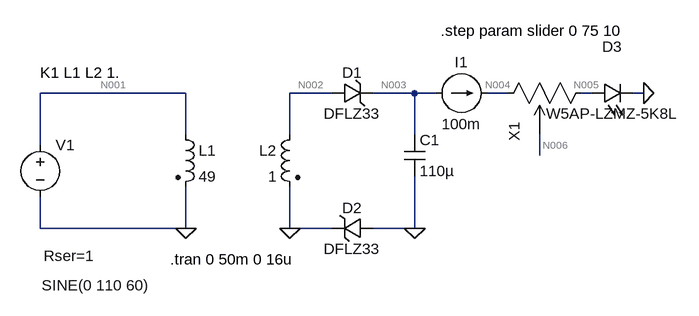
[diagram p0: schematic Fonte Eletrônica.asc]
Fonte Eletrônica.asc, the LTspice schematic file:
Version 4
SHEET 1 880 680
WIRE -400 -240 -624 -240
WIRE -176 -240 -240 -240
WIRE -48 -240 -112 -240
WIRE -16 -240 -48 -240
WIRE 96 -240 64 -240
WIRE 224 -240 208 -240
WIRE 304 -240 288 -240
WIRE -400 -176 -400 -240
WIRE -240 -176 -240 -240
WIRE -48 -176 -48 -240
WIRE -624 -160 -624 -240
WIRE 144 -144 144 -176
WIRE -624 -32 -624 -80
WIRE -400 -32 -400 -96
WIRE -400 -32 -624 -32
WIRE -240 -32 -240 -96
WIRE -176 -32 -240 -32
WIRE -48 -32 -48 -112
WIRE -48 -32 -112 -32
FLAG -400 -32 0
FLAG -240 -32 0
FLAG -48 -32 0
FLAG 304 -240 0
SYMBOL voltage -624 -176 R0
WINDOW 3 2 232 Left 2
WINDOW 123 0 0 Left 0
WINDOW 39 5 187 Left 2
SYMATTR Value SINE(0 110 60)
SYMATTR SpiceLine Rser=1
SYMATTR InstName V1
SYMBOL ind2 -416 -192 R0
SYMATTR InstName L1
SYMATTR Value 49
SYMBOL ind2 -224 -192 M0
SYMATTR InstName L2
SYMATTR Value 1
SYMBOL zener -176 -224 R270
WINDOW 0 32 32 VTop 2
WINDOW 3 0 32 VBottom 2
SYMATTR InstName D1
SYMATTR Value DFLZ33
SYMATTR Description Diode
SYMATTR Type diode
SYMBOL zener -112 -48 R90
WINDOW 0 0 32 VBottom 2
WINDOW 3 32 32 VTop 2
SYMATTR InstName D2
SYMATTR Value DFLZ33
SYMATTR Description Diode
SYMATTR Type diode
SYMBOL cap -64 -176 R0
SYMATTR InstName C1
SYMATTR Value 110µ
SYMBOL pot 112 -224 R270
SYMATTR InstName X1
SYMATTR SpiceLine R=120 Val={slider}
SYMBOL current -16 -240 R270
WINDOW 0 32 40 VTop 2
WINDOW 3 -32 40 VBottom 2
WINDOW 123 4 40 VTop 2
WINDOW 39 0 0 Left 0
SYMATTR InstName I1
SYMATTR Value 100m
SYMBOL LED 224 -224 R270
WINDOW 0 72 32 VTop 2
WINDOW 3 0 32 VBottom 2
SYMATTR InstName D3
SYMATTR Value W5AP-LZMZ-5K8L
TEXT -624 -272 Left 2 !K1 L1 L2 1.
TEXT -424 16 Left 2 !.tran 0 50m 0 16u
TEXT -8 -336 Left 2 !.step param slider 0 75 10

The netlist it stands for:
* Fonte Eletrônica.asc
V1 N001 0 SINE(0 110 60) Rser=1
L1 N001 0 49
L2 N002 0 1
D1 N002 N003 DFLZ33
D2 0 0 DFLZ33
C1 N003 0 110µ
XX1 N004 N005 N006 pot R=120 Val={slider}  ; pins 1 2 3
I1 N003 N004 100m
D3 N005 0 W5AP-LZMZ-5K8L
.model D D
.lib standard.dio
K1 L1 L2 1.
.tran 0 50m 0 16u
.step param slider 0 75 10
.backanno
.end

* Results of the author's LTspice run, read from the files saved beside the schematic
* Operating Point (first step), zero values left out:
*   V(n003) = -708.8 mV
*   V(n004) = 14.9 V
*   V(n006) = 2.897 V
*   V(n005) = 2.897 V
*   I(D3) = 100 mA
*   I(D1) = 100 mA
*   I(L2) = -100 mA
*   I(I1) = 100 mA
*   Ix(x1:1) = 100 mA
*   Ix(x1:2) = -100 mA
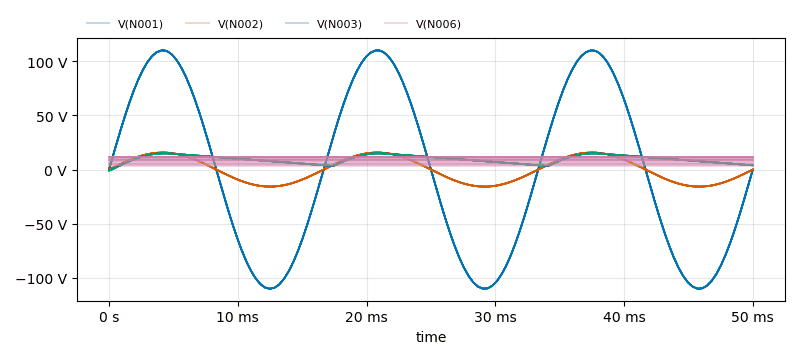
[diagram p1: Transient Analysis of Fonte Eletrônica.asc, plotted from the saved traces]
* Transient Analysis, 9 runs:
*   V(N001) [run 1]: min -110 V, max 110 V, average 11.36 mV, rms 77.75 V, last 14.29 mV
*   V(N001) [run 2]: min -110 V, max 110 V, average 11.29 mV, rms 77.75 V, last 14.29 mV
*   V(N001) [run 3]: min -110 V, max 110 V, average 11.29 mV, rms 77.75 V, last 14.29 mV
*   V(N001) [run 4]: min -110 V, max 110 V, average 11.29 mV, rms 77.75 V, last 14.29 mV
*   V(N001) [run 5]: min -110 V, max 110 V, average 11.29 mV, rms 77.75 V, last 14.29 mV
*   V(N001) [run 6]: min -110 V, max 110 V, average 11.29 mV, rms 77.75 V, last 14.29 mV
*   V(N001) [run 7]: min -110 V, max 110 V, average 11.29 mV, rms 77.75 V, last 14.29 mV
*   V(N001) [run 8]: min -110 V, max 110 V, average 11.29 mV, rms 77.75 V, last 14.29 mV
*   V(N002) [run 1]: min -15.71 V, max 15.71 V, average 1.623 mV, rms 11.11 V, last 2.042 mV
*   V(N002) [run 2]: min -15.71 V, max 15.71 V, average 1.613 mV, rms 11.11 V, last 2.042 mV
*   V(N002) [run 3]: min -15.71 V, max 15.71 V, average 1.613 mV, rms 11.11 V, last 2.042 mV
*   V(N002) [run 4]: min -15.71 V, max 15.71 V, average 1.613 mV, rms 11.11 V, last 2.042 mV
*   V(N002) [run 5]: min -15.71 V, max 15.71 V, average 1.613 mV, rms 11.11 V, last 2.042 mV
*   V(N002) [run 6]: min -15.71 V, max 15.71 V, average 1.613 mV, rms 11.11 V, last 2.042 mV
*   V(N002) [run 7]: min -15.71 V, max 15.71 V, average 1.613 mV, rms 11.11 V, last 2.042 mV
*   V(N002) [run 8]: min -15.71 V, max 15.71 V, average 1.613 mV, rms 11.11 V, last 2.042 mV
*   V(N003) [run 1]: min -708.8 mV, max 14.99 V, average 9.528 V, rms 10.19 V, last 3.933 V
*   V(N003) [run 2]: min -708.8 mV, max 14.99 V, average 9.528 V, rms 10.19 V, last 3.933 V
*   V(N003) [run 3]: min -708.8 mV, max 14.99 V, average 9.528 V, rms 10.19 V, last 3.933 V
*   V(N003) [run 4]: min -708.8 mV, max 14.99 V, average 9.528 V, rms 10.19 V, last 3.933 V
*   V(N003) [run 5]: min -708.8 mV, max 14.99 V, average 9.528 V, rms 10.19 V, last 3.933 V
*   V(N003) [run 6]: min -708.8 mV, max 14.99 V, average 9.528 V, rms 10.19 V, last 3.933 V
*   V(N003) [run 7]: min -708.8 mV, max 14.99 V, average 9.528 V, rms 10.19 V, last 3.933 V
*   V(N003) [run 8]: min -708.8 mV, max 14.99 V, average 9.528 V, rms 10.19 V, last 3.933 V
*   V(N006) [run 1]: min 2.897 V, max 2.897 V, average 2.897 V, rms 2.897 V, last 2.897 V
*   V(N006) [run 2]: min 4.097 V, max 4.097 V, average 4.097 V, rms 4.097 V, last 4.097 V
*   V(N006) [run 3]: min 5.297 V, max 5.297 V, average 5.297 V, rms 5.297 V, last 5.297 V
*   V(N006) [run 4]: min 6.497 V, max 6.497 V, average 6.497 V, rms 6.497 V, last 6.497 V
*   V(N006) [run 5]: min 7.697 V, max 7.697 V, average 7.697 V, rms 7.697 V, last 7.697 V
*   V(N006) [run 6]: min 8.897 V, max 8.897 V, average 8.897 V, rms 8.897 V, last 8.897 V
*   V(N006) [run 7]: min 10.1 V, max 10.1 V, average 10.1 V, rms 10.1 V, last 10.1 V
*   V(N006) [run 8]: min 11.3 V, max 11.3 V, average 11.3 V, rms 11.3 V, last 11.3 V